# Altium schematic sheet Root.SchDoc
size A4; SheetNumber: 2; SheetTotal: 6
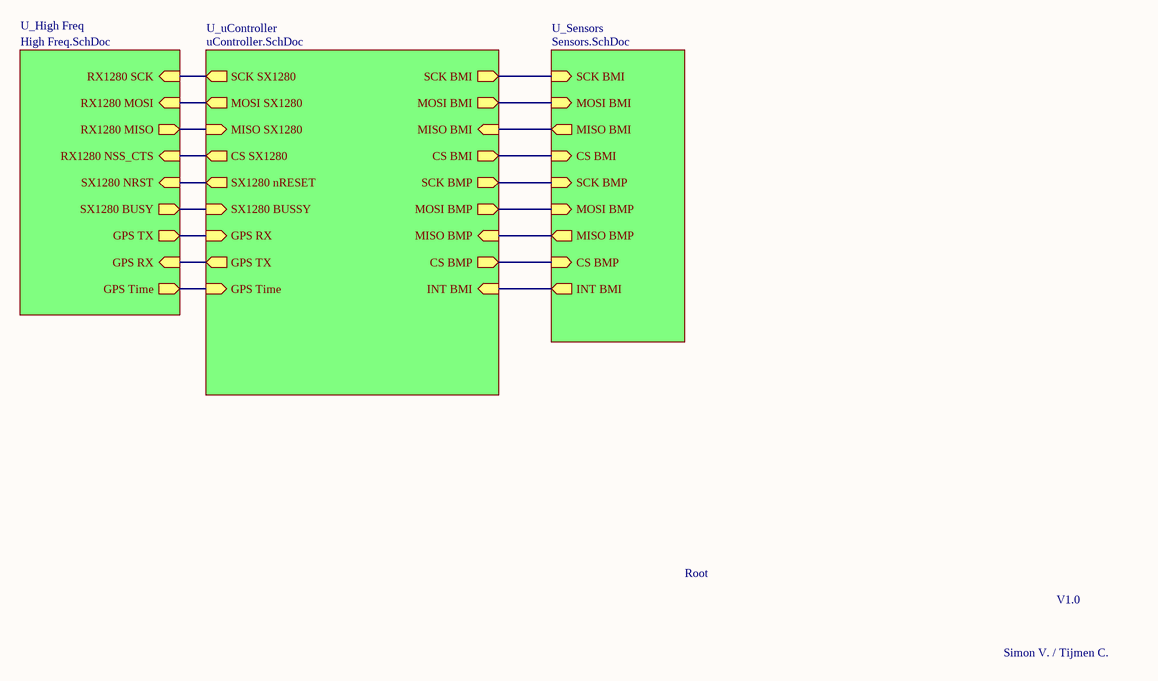
[diagram p0: Root.SchDoc]

## Sub-sheets
U_High Freq = High Freq.SchDoc: SX1280 BUSY (out), SX1280 NRST (in), RX1280 MISO (out), RX1280 MOSI (in), RX1280 SCK (in), RX1280 NSS_CTS (in), GPS RX (in), GPS TX (out), GPS Time (out)
U_Sensors = Sensors.SchDoc: MOSI BMI (in), SCK BMI (in), CS BMI (in), MISO BMI (out), MOSI BMP (in), SCK BMP (in), CS BMP (in), MISO BMP (out), INT BMI (out)
U_uController = uController.SchDoc: CS BMI (out), CS SX1280 (out), MISO BMI (in), MISO SX1280 (in), MOSI BMI (out), MOSI SX1280 (out), SCK BMI (out), SCK SX1280 (out), CS BMP (out), MISO BMP (in), MOSI BMP (out), SCK BMP (out), GPS Time (in), SX1280 nRESET (out), SX1280 BUSSY (in), GPS RX (in), GPS TX (out), INT BMI (in)

## Nets
(unnamed): sheet U_uController/CS BMI, sheet U_Sensors/CS BMI
(unnamed): sheet U_uController/CS SX1280, sheet U_High Freq/RX1280 NSS_CTS
(unnamed): sheet U_uController/MISO BMI, sheet U_Sensors/MISO BMI
(unnamed): sheet U_uController/MISO SX1280, sheet U_High Freq/RX1280 MISO
(unnamed): sheet U_uController/MOSI BMI, sheet U_Sensors/MOSI BMI
(unnamed): sheet U_uController/MOSI SX1280, sheet U_High Freq/RX1280 MOSI
(unnamed): sheet U_uController/SCK BMI, sheet U_Sensors/SCK BMI
(unnamed): sheet U_uController/SCK SX1280, sheet U_High Freq/RX1280 SCK
(unnamed): sheet U_uController/CS BMP, sheet U_Sensors/CS BMP
(unnamed): sheet U_uController/MISO BMP, sheet U_Sensors/MISO BMP
(unnamed): sheet U_uController/MOSI BMP, sheet U_Sensors/MOSI BMP
(unnamed): sheet U_uController/SCK BMP, sheet U_Sensors/SCK BMP
(unnamed): sheet U_uController/GPS Time, sheet U_High Freq/GPS Time
(unnamed): sheet U_uController/SX1280 nRESET, sheet U_High Freq/SX1280 NRST
(unnamed): sheet U_uController/SX1280 BUSSY, sheet U_High Freq/SX1280 BUSY
(unnamed): sheet U_uController/GPS RX, sheet U_High Freq/GPS TX
(unnamed): sheet U_uController/GPS TX, sheet U_High Freq/GPS RX
(unnamed): sheet U_uController/INT BMI, sheet U_Sensors/INT BMI

## Notes on the sheet
- Root
- V1.0
- Simon V. / Tijmen C.